# Altium schematic sheet Sheet_1_2022-08-15.schdoc
size 293 x 193 mm
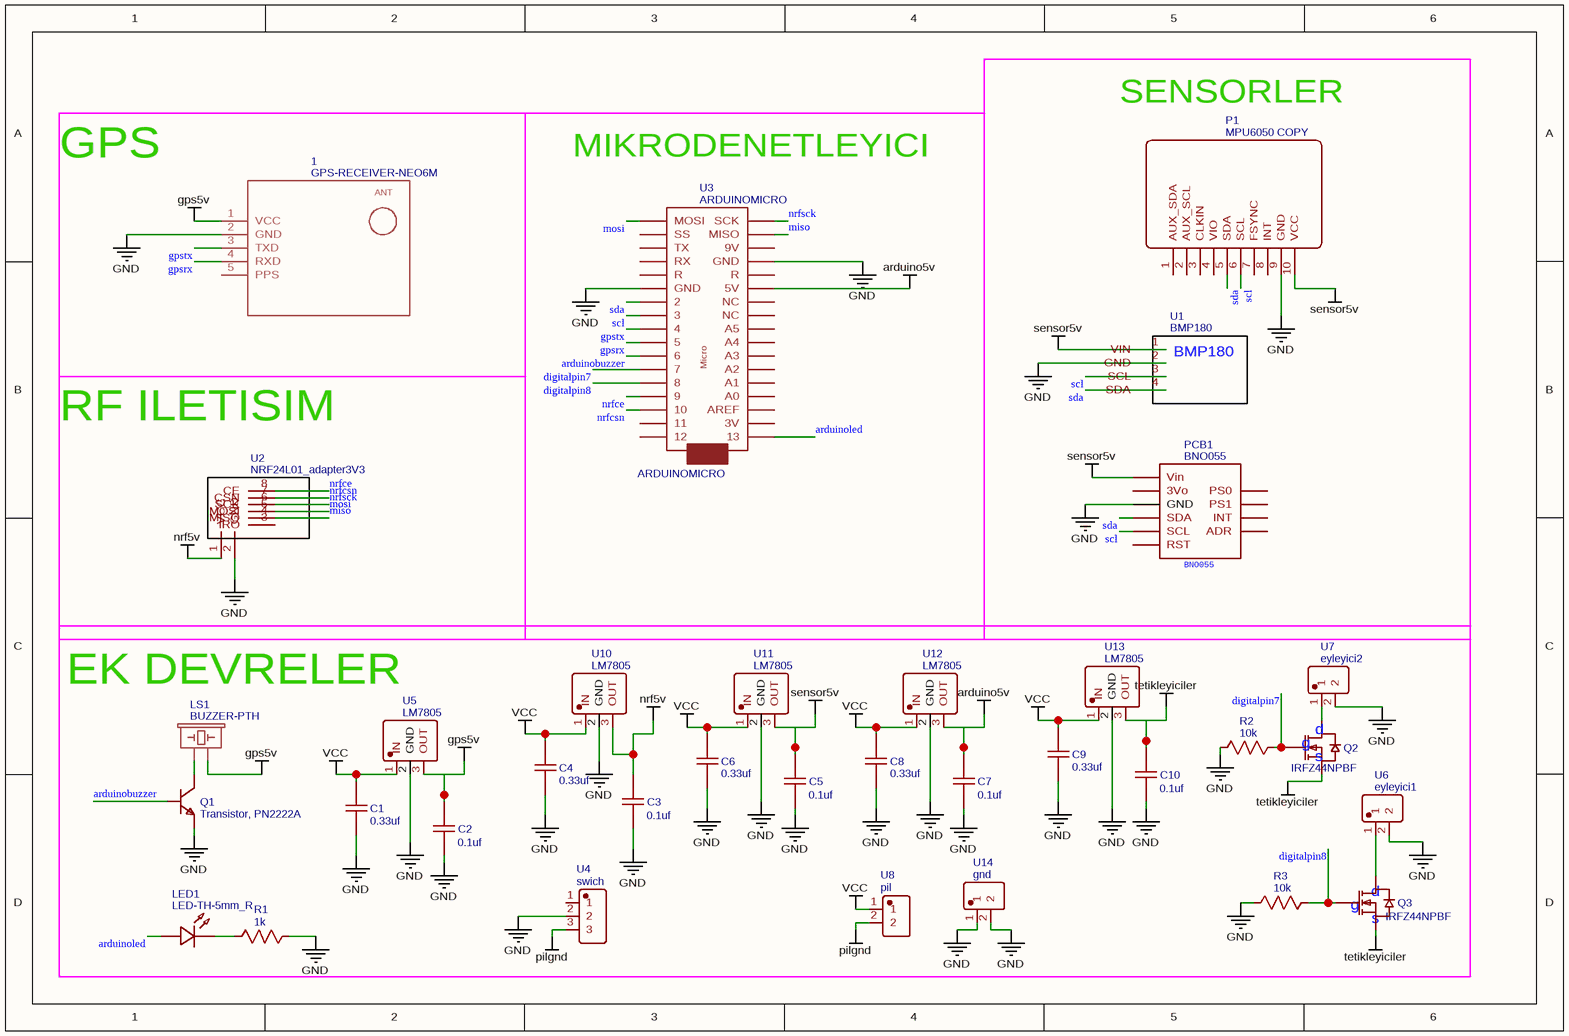
[diagram p0: Sheet_1_2022-08-15.schdoc]

## Parts
1  GPS-RECEIVER-NEO6M  [GPS FOOTPRINT]
C1  0.33uf  [RAD-0.1]
C2  0.1uf  [RAD-0.1]
C3  0.1uf  [RAD-0.1]
C4  0.33uf  [RAD-0.1]
C5  0.1uf  [RAD-0.1]
C6  0.33uf  [RAD-0.1]
C7  0.1uf  [RAD-0.1]
C8  0.33uf  [RAD-0.1]
C9  0.33uf  [RAD-0.1]
C10  0.1uf  [RAD-0.1]
LED1  LED-TH-5mm_R  [LED-TH_BD5.0_RED]
LS1  BUZZER-PTH  [BUZZER-12MM]
P1  MPU6050 COPY  [MPU6050]
PCB1  BNO055  [BNO FOOTPRINT]
Q1  Transistor, PN2222A  [GENERIC_TO-92]
Q2  IRFZ44NPBF  [TO-220-3_L10.0-W4.5-P2.54-L]
Q3  IRFZ44NPBF  [TO-220-3_L10.0-W4.5-P2.54-L]
R1  1k  [R_AXIAL-0.3]
R2  10k  [R_AXIAL-0.3]
R3  10k  [R_AXIAL-0.3]
U1  BMP180  [BMP180 FOOTPRINT]
U2  NRF24L01_adapter3V3  [NRF24L01_ADAPTER3V3]
U3  ARDUINOMICRO  [ARDUINOMICRO]
U4  swich  [NEW_FOOTPRINT]
U5  LM7805  [TO-220-3_L10.0-W4.5-P2.54-L]
U6  eyleyici1  [JST- XH 2.54MM SOKET 2LI]
U7  eyleyici2  [JST- XH 2.54MM SOKET 2LI]
U8  pil  [JST- XH 2.54MM SOKET 2LI]
U10  LM7805  [TO-220-3_L10.0-W4.5-P2.54-L]
U11  LM7805  [TO-220-3_L10.0-W4.5-P2.54-L]
U12  LM7805  [TO-220-3_L10.0-W4.5-P2.54-L]
U13  LM7805  [TO-220-3_L10.0-W4.5-P2.54-L]
U14  gnd  [JST- XH 2.54MM SOKET 2LI]

## Blocks framed on the sheet
SENSORLER: P1 PCB1 U1
GPS: 1
MIKRODENETLEYICI: U3
RF ILETISIM: U2
EK DEVRELER: C1-C10 LED1 LS1 Q1-Q3 R1-R3 U4-U8 U10-U14

## Nets
arduino5v: C7.2 U3.P$23(5V) U12.3(OUT)
GND: 1.2(GND) C1.1 C2.1 C3.1 C4.1 C5.1 C6.1 C7.1 C8.1 C9.1 C10.1 P1.9(GND) PCB1.3(GND) Q1.1(E) R1.2 R2.1 R3.1 U1.2(GND) U2.2(GND) U3.P$12(GND) U3.P$21(GND) U4.2 U5.2(GND) U6.2 U7.2 U10.2(GND) U11.2(GND) U12.2(GND) U13.2(GND) U14.1 U14.2
gps5v: 1.1(VCC) C2.2 LS1.- U5.3(OUT)
nrf5v: C3.2 U2.1(VCC) U10.3(OUT)
pilgnd: U4.3 U8.2
sensor5v: C5.2 P1.10(VCC) PCB1.1(Vin) U1.1(VIN) U11.3(OUT)
tetikleyiciler: C10.2 Q2.3(S) Q3.3(S) U13.3(OUT)
VCC: C1.2 C4.2 C6.2 C8.2 C9.2 U5.1(IN) U8.1 U10.1(IN) U11.1(IN) U12.1(IN) U13.1(IN)
arduinobuzzer: Q1.2(B) U3.P$7(6)
arduinoled: LED1.1 U3.P$34(13)
digitalpin7: Q2.1(G) R2.2 U3.P$6(7)
digitalpin8: Q3.1(G) R3.2 U3.P$5(8)
gpsrx: 1.4(RXD) U3.P$8(5)
gpstx: 1.3(TXD) U3.P$9(4)
miso: U2.4(MISO) U3.P$19(MISO)
mosi: U2.5(MOSI) U3.P$17(MOSI)
nrfce: U2.8(CE) U3.P$4(9)
nrfcsn: U2.7(CSN) U3.P$3(10)
nrfsck: U2.6(SCK) U3.P$18(SCK)
scl: P1.6(SCL) PCB1.5(SCL) U1.3(SCL) U3.P$10(3)
sda: P1.5(SDA) PCB1.4(SDA) U1.4(SDA) U3.P$11(2)
NetLED1_2: LED1.2 R1.1
NetLS1_+: LS1.+ Q1.3(C)
NetQ2_2: Q2.2(D) U7.1
NetQ3_2: Q3.2(D) U6.1

Not connected (* = marked no-connect by the designer): 1 5(PPS); P1 1(AUX_SDA) 2(AUX_SCL) 3(CLKIN) 4(VIO) 7(FSYNC) 8(INT); PCB1 2(3Vo) 6(RST) 7(PS0) 8(PS1) 9(INT) 10(ADR); U2 3(IRO); U3 P$1(12) P$2(11) P$13(R) P$14(RX) P$15(TX) P$16(SS) P$20(9V) P$22(R) P$24(NC) P$25(NC) P$26(A5) P$27(A4) P$28(A3) P$29(A2) P$30(A1) P$31(A0) P$32(AREF) P$33(3V); U4 1

## Notes on the sheet
- (near Q2) g
- (near Q2) d
- (near Q2) s
- (near Q3) g
- (near Q3) d
- (near Q3) s
- (in symbol ARDUINOMICRO) Micro
- (in symbol GPS-RECEIVER-NEO6M) ANT

## Library data of the parts
1 = GPS-RECEIVER-NEO6M: Contributor: Otto Sonneveld; spicePre: ?; spiceSymbolName: GPS-RECEIVER-NEO6M
C1 C4 C6 C8 C9 = 0.33uf: nameAlias: Value(F); Contributor: LCEDA_Lib; spicePre: C; spiceSymbolName: C_RAD-0.1_US
C2 C3 C5 C7 C10 = 0.1uf: nameAlias: Value(F); Contributor: LCEDA_Lib; spicePre: C; spiceSymbolName: C_RAD-0.1_US
LED1 = LED-TH-5mm_R: BOM_Manufacturer: EVERLIGHT(台湾亿光); BOM_Manufacturer Part: 333-2SURD/S530-A3; Contributor: LCEDA_Lib; BOM_Supplier Part: C87271; BOM_Supplier: LCSC; spicePre: L; spiceSymbolName: LED-TH-5mm_R
LS1 = BUZZER-PTH: Contributor: Maxime Djouf; spicePre: L; spiceSymbolName: BUZZER-PTH
P1 = MPU6050 COPY: sourceId: 1T5FDZYC8; timeStamp: 1462265206; spicePre: P; spiceSymbolName: MPU6050 COPY
Q1 = Transistor, PN2222A: Contributor: benjamin.nemec; BOM_Manufacturer Part: PN2222A; spicePre: Q; spiceSymbolName: Transistor, PN2222A
Q2 Q3 = IRFZ44NPBF: BOM_Manufacturer: IR; BOM_Supplier: LCSC; BOM_Manufacturer Part: IRFZ44NPBF; BOM_Supplier Part: C2586; BOM_JLCPCB Part Class: Extended Part; spicePre: Q; spiceSymbolName: IRFZ44NPBF
R1 = 1k: nameAlias: Value(Ω); Contributor: LCEDA_Lib; spicePre: R; spiceSymbolName: R_AXIAL-0.3_US
R2 R3 = 10k: nameAlias: Value(Ω); Contributor: LCEDA_Lib; spicePre: R; spiceSymbolName: R_AXIAL-0.3_US
U1 = BMP180: Contributor: delil1220; BOM_Manufacturer Part: BMP180; spicePre: U; spiceSymbolName: BMP180
U2 = NRF24L01_adapter3V3: Contributor: boonchuan khongsupsinsiri; spicePre: U; spiceSymbolName: NRF24L01_adapter3V3
U3 = ARDUINOMICRO: Package Display: Yes; timeStamp: 1464178696; spicePre: U; spiceSymbolName: ARDUINOMICRO
U4 = swich: Contributor: kenanbatur4; spicePre: U; spiceSymbolName: swich
U5 U10-U13 = LM7805: BOM_Manufacturer: TF; Contributor: LCSC; BOM_Supplier: LCSC; BOM_Supplier Part: C845394; BOM_Manufacturer Part: LM7805; BOM_JLCPCB Part Class: Extended Part; spicePre: U; spiceSymbolName: LM7805
U6 = eyleyici1: Contributor: kenanbatur; spicePre: U; spiceSymbolName: JST- XH 2.54mm Soket
U7 = eyleyici2: Contributor: kenanbatur; spicePre: U; spiceSymbolName: JST- XH 2.54mm Soket
U8 = pil: Contributor: kenanbatur; spicePre: U; spiceSymbolName: JST- XH 2.54mm Soket
U14 = gnd: Contributor: kenanbatur; spicePre: U; spiceSymbolName: JST- XH 2.54mm Soket
PCB1 = BNO055: BOM_Manufacturer Part: BNO055; BOM_Supplier Part: BNO055; BOM_Supplier: AdaFruit; link: https://learn.adafruit.com/adafruit-bno055-absolute-orientation-sensor/overview; spicePre: P; spiceSymbolName: BNO055